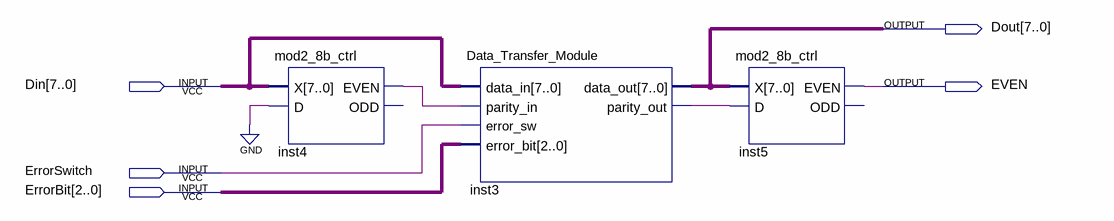
[diagram p0: schematic sheet]
// Quartus schematic temp.bdf as structural Verilog: 3 symbols, 5 pins
module temp (
  input  [7:0] Din,
  input  ErrorSwitch,
  input  [2:0] ErrorBit,
  output [7:0] Dout,
  output EVEN
);

  wire inst3_parity_out, inst4_even;

  mod2_8b_ctrl inst4 (.X(Din), .D(1'b0), .EVEN(inst4_even));  // open: ODD
  Data_Transfer_Module inst3 (
    .data_in(Din), .parity_in(inst4_even), .error_sw(ErrorSwitch), .error_bit(ErrorBit), .data_out(Dout),
    .parity_out(inst3_parity_out));
  mod2_8b_ctrl inst5 (.X(Dout), .D(inst3_parity_out), .EVEN(EVEN));  // open: ODD
endmodule
